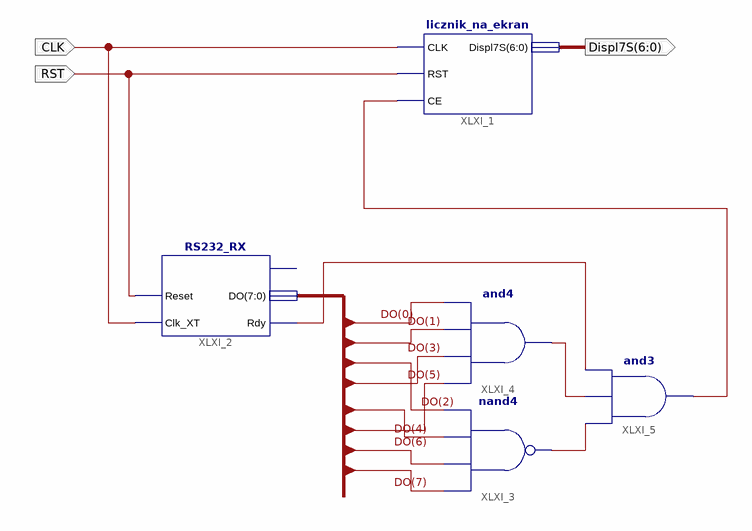
[diagram p0: schematic sheet 1]
// Xilinx ISE schematic licznik_na_plusa_na_ekran.sch (xc9500xl) as structural Verilog: 5 symbols, 3 ports
module licznik_na_plusa_na_ekran (
  input  RST,
  input  CLK,
  output [6:0] Displ7S
);

  wire XLXN_14, XLXN_15, XLXN_16, XLXN_17;
  wire [7:0] DO;

  licznik_na_ekran XLXI_1 (.CLK(CLK), .RST(RST), .CE(XLXN_17), .Displ7S(Displ7S));
  RS232_RX XLXI_2 (.Reset(RST), .Clk_XT(CLK), .Rdy(XLXN_16), .DO(DO));  // open: RS_RX
  nand XLXI_3 (XLXN_15, DO[7], DO[6], DO[4], DO[2]);
  and XLXI_4 (XLXN_14, DO[5], DO[3], DO[1], DO[0]);
  and XLXI_5 (XLXN_17, XLXN_15, XLXN_14, XLXN_16);
endmodule
